# EAGLE schematic BackBoard (EAGLE 9.6.2)
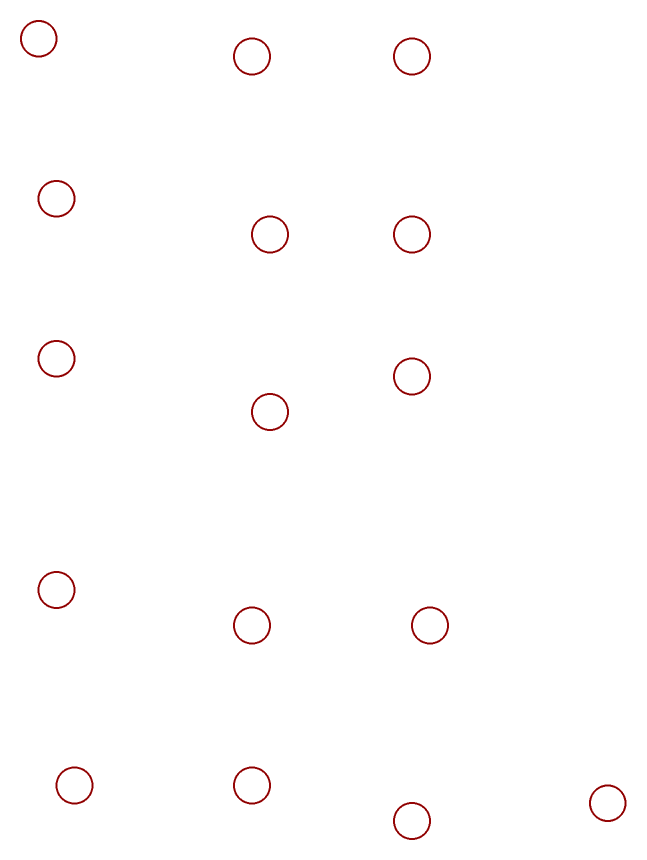
[diagram p0: schematic, sheet 1]

## Parts
V1  VENT  [VENT]
V2  VENT  [VENT]
V3  VENT  [VENT]
V4  VENT  [VENT]
V5  VENT  [VENT]
V6  VENT  [VENT]
V7  VENT  [VENT]
V8  VENT  [VENT]
V9  VENT  [VENT]
V10  VENT  [VENT]
V11  VENT  [VENT]
V12  VENT  [VENT]
V13  VENT  [VENT]
V14  VENT  [VENT]
V15  VENT  [VENT]
V16  VENT  [VENT]

## Library data of the parts
V1-V16 = VENT:VENT

## Net classes
1 wide keepout: clearance 0.508 mm
2 12V: width 0.254 mm, clearance 0.508 mm